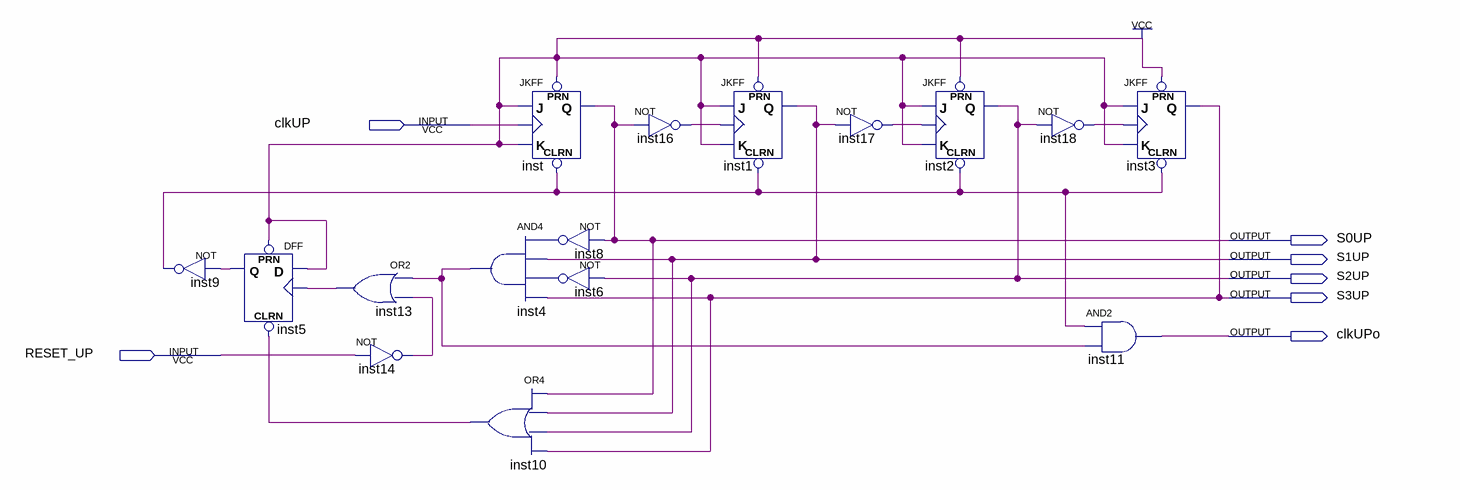
[diagram p0: schematic sheet]
// Quartus schematic contUP.bdf as structural Verilog: 16 symbols, 7 pins
module contUP (
  input  clkUP,
  input  RESET_UP,
  output S0UP,
  output S1UP,
  output S2UP,
  output S3UP,
  output clkUPo
);

  wire inst4_out, inst5_q, inst6_out, inst8_out, inst9_out, inst10_out, inst13_out, inst14_out, inst16_out,
       inst17_out, inst18_out;

  not inst9 (inst9_out, inst5_q);
  DFF inst5 (.CLRN(inst10_out), .CLK(inst13_out), .D(1'b1), .PRN(1'b1), .Q(inst5_q));
  or inst13 (inst13_out, inst4_out, inst14_out);
  not inst14 (inst14_out, RESET_UP);
  JKFF inst (.PRN(1'b1), .CLRN(inst9_out), .K(1'b1), .J(1'b1), .CLK(clkUP), .Q(S0UP));
  and inst4 (inst4_out, inst8_out, S1UP, inst6_out, S3UP);
  or inst10 (inst10_out, S0UP, S1UP, S2UP, S3UP);
  not inst8 (inst8_out, S0UP);
  not inst6 (inst6_out, S2UP);
  not inst16 (inst16_out, S0UP);
  JKFF inst1 (.PRN(1'b1), .CLRN(inst9_out), .K(1'b1), .J(1'b1), .CLK(inst16_out), .Q(S1UP));
  not inst17 (inst17_out, S1UP);
  JKFF inst2 (.PRN(1'b1), .CLRN(inst9_out), .K(1'b1), .J(1'b1), .CLK(inst17_out), .Q(S2UP));
  not inst18 (inst18_out, S2UP);
  JKFF inst3 (.PRN(1'b1), .CLRN(inst9_out), .K(1'b1), .J(1'b1), .CLK(inst18_out), .Q(S3UP));
  and inst11 (clkUPo, inst9_out, inst4_out);
endmodule
